# Altium schematic sheet CAN BUS FOR STM32.SchDoc
size A2
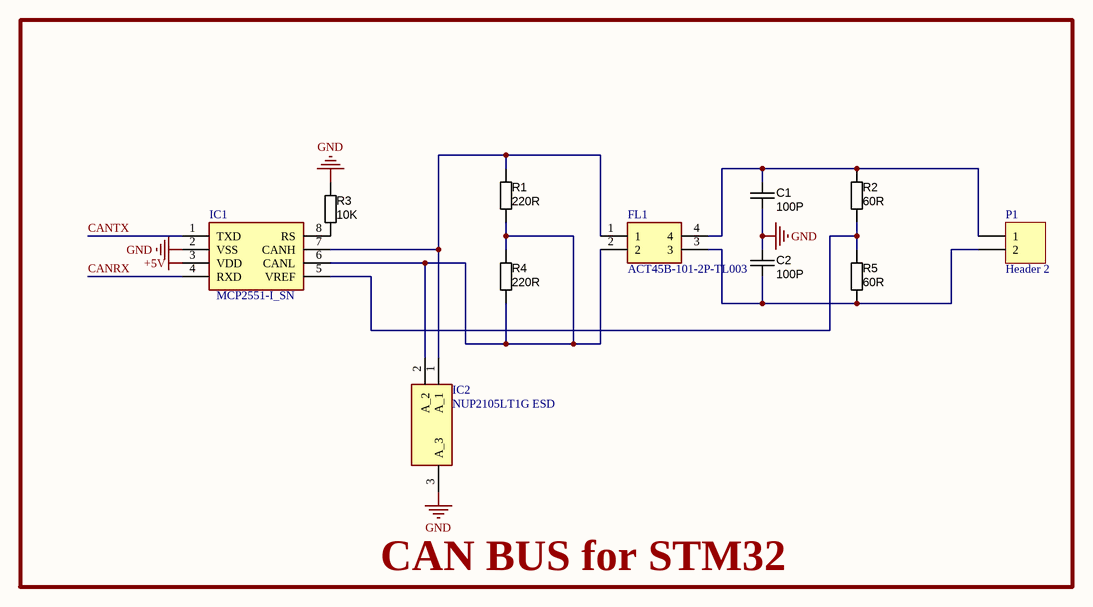
[diagram p0: CAN BUS FOR STM32.SchDoc]

## Parts
C1  value 100P  [CAPC2012X135N]  (hidden comment: approved sub OK)
C2  value 100P  [CAPC2012X135N]  (hidden comment: approved sub OK)
FL1  ACT45B-101-2P-TL003  [ACT45B1012PTL003]
IC1  MCP2551-I_SN  [SOIC127P600X175-8N]
IC2  NUP2105LT1G ESD  [SOT96P237X111-3N]
P1  Header 2  [Terminal kf128 2pin 5.0]
R1  value 220R  [RESC2012N_ZERO]  (hidden comment: Jumper)
R2  value 60R  [RESC2012N_ZERO]  (hidden comment: Jumper)
R3  value 10K  [RESC2012N_ZERO]  (hidden comment: Jumper)
R4  value 220R  [RESC2012N_ZERO]  (hidden comment: Jumper)
R5  value 60R  [RESC2012N_ZERO]  (hidden comment: Jumper)

## Blocks framed on the sheet
CAN BUS for STM32: C1 C2 FL1 IC1 IC2 P1 R1-R5

## Nets
+5V: IC1.3(VDD)
GND: C1.2 C2.1 IC1.2(VSS) IC2.3(A_3) R3.1
CANRX: IC1.4(RXD)
CANTX: IC1.1(TXD)
NetC1_1: C1.1 FL1.4 P1.1 R2.1
NetC2_2: C2.2 FL1.3 P1.2 R5.2
NetFL1_1: FL1.1 IC1.7(CANH) IC2.1(A_1) R1.1
NetFL1_2: FL1.2 IC1.6(CANL) IC2.2(A_2) R1.2 R4.1 R4.2
NetIC1_5: IC1.5(VREF) R2.2 R5.1
NetIC1_8: IC1.8(RS) R3.2

## Library data of the parts
C1 C2 = CAPC_100n_0805_X7R_100V_10%: Capacitor SMD Cer 100pF 10% 100V X7R 0805; Manufacturer 1: TDK Corporation; Manufacturer Part Number 1: C2012X7R2A104K; Ratings: 100V; X7R; Material: ceramic; SCDType: undef; Package / Case: 0805; Tolerance: ±10%; Supplier 1: Digi-Key; Supplier Part Number 1: 445-1418-1-ND
FL1 = ACT45B-101-2P-TL003: Filter; Manufacturer_Name: TDK; Datasheet Link: https://product.tdk.com/system/files/dam/doc/product/emc/emc/cmf_cmc/catalog/cmf_automotive_signal_act45b_en.pdf; Height: 3mm; Manufacturer_Part_Number: ACT45B-101-2P-TL003; Mouser Part Number: 810-ACT45B1012PTL003; Mouser Price/Stock: https://www.mouser.co.uk/ProductDetail/TDK/ACT45B-101-2P-TL003?qs=SKgu1TwNDxoLFWvwfqJuJA%3D%3D; Arrow Part Number: ACT45B-101-2P-TL003; Arrow Price/Stock: https://www.arrow.com/en/products/act45b-101-2p-tl003/tdk?region=nac
IC1 = MCP2551-I_SN: Integrated Circuit; Manufacturer_Name: Microchip; Manufacturer_Part_Number: MCP2551-I/SN; Datasheet Link: https://datasheet.datasheetarchive.com/originals/distributors/Datasheets-34/DSA-674994.pdf; Height: 1.75mm; Mouser Part Number: 579-MCP2551-I/SN; Mouser Price/Stock: https://www.mouser.co.uk/ProductDetail/Microchip-Technology/MCP2551-I-SN?qs=9y3LFqDLL8L5zFfqqxdOHg%3D%3D; Arrow Part Number: MCP2551-I/SN; Arrow Price/Stock: https://www.arrow.com/en/products/mcp2551-isn/microchip-technology?region=nac
IC2 = NUP2105LT1G: Integrated Circuit; Manufacturer_Name: onsemi; Datasheet Link: https://www.onsemi.com/pub/Collateral/NUP2105L-D.PDF; Height: 1.11mm; Manufacturer_Part_Number: NUP2105LT1G; Mouser Part Number: 863-NUP2105LT1G; Mouser Price/Stock: https://www.mouser.co.uk/ProductDetail/onsemi/NUP2105LT1G?qs=ZXBb0xZ9WeDHmiHN%252BYKtYA%3D%3D; Arrow Part Number: NUP2105LT1G; Arrow Price/Stock: https://www.arrow.com/en/products/nup2105lt1g/on-semiconductor?region=nac
P1 = Header 2: Header, 2-Pin; LatestRevisionDate: 17-Jul-2002; LatestRevisionNote: Re-released for DXP Platform.; Publisher: Altium Limited
R1 R4 = RES_0R_0805: Resistor SMD chip 220 Ohm 0.125W 0805; Manufacturer 1: Samsung Electro-Mechanics America, Inc; Manufacturer Part Number 1: RC2012J000CS; Ratings: 1/8W; SCDType: spec; Tolerance: N/A; Package / Case: 0805 (2012 metric); Supplier 1: Digi-Key; Supplier Part Number 1: 1276-5466-6-ND; RoHS 1: RoHS Compliant; ComponentLink1URL: http://www.samsungsem.com/servlet/FileDownload?filename=productcatalog/pdf/Chip_Resistor.pdf; ComponentLink1Description: http://www.samsungsem.com/servlet/FileDownload?filename=productcatalog/pdf/Chip_Resistor.pdf; Supplier 2: Digi-Key; Supplier Part Number 2: RMCF0805ZT0R00DKR-ND; Manufacturer 2: Stackpole Electronics Inc; Manufacturer Part Number 2: RMCF0805ZT0R00; RoHS 2: RoHS Compliant; ComponentLink2URL: http://www.seielect.com/Catalog/SEI-RMCF_RMCP.pdf; ComponentLink2Description: http://www.seielect.com/Catalog/SEI-RMCF_RMCP.pdf; Supplier 3: Digi-Key; Supplier Part Number 3: 311-0.0ARDKR-ND; Manufacturer 3: Yageo; Manufacturer Part Number 3: RC0805JR-070RL; RoHS 3: RoHS Compliant; ComponentLink3URL: http://media.digikey.com/pdf/Data%20Sheets/Yageo%20PDFs/RC0805%20Pb%20Free.pdf; ComponentLink3Description: http://media.digikey.com/pdf/Data%20Sheets/Yageo%20PDFs/RC0805%20Pb%20Free.pdf; Supplier 4: Digi-Key; Supplier Part Number 4: P0.0ADKR-ND; Manufacturer 4: Panasonic Electronic Components; Manufacturer Part Number 4: ERJ-6GEY0R00V; RoHS 4: RoHS Compliant; ComponentLink4URL: http://industrial.panasonic.com/www-cgi/jvcr13pz.cgi?E+PZ+3+AOA0001+ERJ6GEY0R00V+7+WW; ComponentLink4Description: http://industrial.panasonic.com/www-cgi/jvcr13pz.cgi?E+PZ+3+AOA0001+ERJ6GEY0R00V+7+WW; Supplier 5: Digi-Key; Supplier Part Number 5: RHM0.0CPDKR-ND; Manufacturer 5: Rohm Semiconductor; Manufacturer Part Number 5: MCR10ERTJ000; RoHS 5: RoHS Compliant; ComponentLink5URL: http://rohmfs.rohm.com/en/products/databook/datasheet/passive/resistor/chip_resistor/mcr_g.pdf; ComponentLink5Description: http://rohmfs.rohm.com/en/products/databook/datasheet/passive/resistor/chip_resistor/mcr_g.pdf
R2 R5 = RES_0R_0805: Resistor SMD chip 60 Ohm 0.125W 0805; Manufacturer 1: Samsung Electro-Mechanics America, Inc; Manufacturer Part Number 1: RC2012J000CS; Ratings: 1/8W; SCDType: spec; Tolerance: N/A; Package / Case: 0805 (2012 metric); Supplier 1: Digi-Key; Supplier Part Number 1: 1276-5466-6-ND; RoHS 1: RoHS Compliant; ComponentLink1URL: http://www.samsungsem.com/servlet/FileDownload?filename=productcatalog/pdf/Chip_Resistor.pdf; ComponentLink1Description: http://www.samsungsem.com/servlet/FileDownload?filename=productcatalog/pdf/Chip_Resistor.pdf; Supplier 2: Digi-Key; Supplier Part Number 2: RMCF0805ZT0R00DKR-ND; Manufacturer 2: Stackpole Electronics Inc; Manufacturer Part Number 2: RMCF0805ZT0R00; RoHS 2: RoHS Compliant; ComponentLink2URL: http://www.seielect.com/Catalog/SEI-RMCF_RMCP.pdf; ComponentLink2Description: http://www.seielect.com/Catalog/SEI-RMCF_RMCP.pdf; Supplier 3: Digi-Key; Supplier Part Number 3: 311-0.0ARDKR-ND; Manufacturer 3: Yageo; Manufacturer Part Number 3: RC0805JR-070RL; RoHS 3: RoHS Compliant; ComponentLink3URL: http://media.digikey.com/pdf/Data%20Sheets/Yageo%20PDFs/RC0805%20Pb%20Free.pdf; ComponentLink3Description: http://media.digikey.com/pdf/Data%20Sheets/Yageo%20PDFs/RC0805%20Pb%20Free.pdf; Supplier 4: Digi-Key; Supplier Part Number 4: P0.0ADKR-ND; Manufacturer 4: Panasonic Electronic Components; Manufacturer Part Number 4: ERJ-6GEY0R00V; RoHS 4: RoHS Compliant; ComponentLink4URL: http://industrial.panasonic.com/www-cgi/jvcr13pz.cgi?E+PZ+3+AOA0001+ERJ6GEY0R00V+7+WW; ComponentLink4Description: http://industrial.panasonic.com/www-cgi/jvcr13pz.cgi?E+PZ+3+AOA0001+ERJ6GEY0R00V+7+WW; Supplier 5: Digi-Key; Supplier Part Number 5: RHM0.0CPDKR-ND; Manufacturer 5: Rohm Semiconductor; Manufacturer Part Number 5: MCR10ERTJ000; RoHS 5: RoHS Compliant; ComponentLink5URL: http://rohmfs.rohm.com/en/products/databook/datasheet/passive/resistor/chip_resistor/mcr_g.pdf; ComponentLink5Description: http://rohmfs.rohm.com/en/products/databook/datasheet/passive/resistor/chip_resistor/mcr_g.pdf
R3 = RES_0R_0805: Resistor SMD chip 10KOhm 0.125W 0805; Manufacturer 1: Samsung Electro-Mechanics America, Inc; Manufacturer Part Number 1: RC2012J000CS; Ratings: 1/8W; SCDType: spec; Tolerance: N/A; Package / Case: 0805 (2012 metric); Supplier 1: Digi-Key; Supplier Part Number 1: 1276-5466-6-ND; RoHS 1: RoHS Compliant; ComponentLink1URL: http://www.samsungsem.com/servlet/FileDownload?filename=productcatalog/pdf/Chip_Resistor.pdf; ComponentLink1Description: http://www.samsungsem.com/servlet/FileDownload?filename=productcatalog/pdf/Chip_Resistor.pdf; Supplier 2: Digi-Key; Supplier Part Number 2: RMCF0805ZT0R00DKR-ND; Manufacturer 2: Stackpole Electronics Inc; Manufacturer Part Number 2: RMCF0805ZT0R00; RoHS 2: RoHS Compliant; ComponentLink2URL: http://www.seielect.com/Catalog/SEI-RMCF_RMCP.pdf; ComponentLink2Description: http://www.seielect.com/Catalog/SEI-RMCF_RMCP.pdf; Supplier 3: Digi-Key; Supplier Part Number 3: 311-0.0ARDKR-ND; Manufacturer 3: Yageo; Manufacturer Part Number 3: RC0805JR-070RL; RoHS 3: RoHS Compliant; ComponentLink3URL: http://media.digikey.com/pdf/Data%20Sheets/Yageo%20PDFs/RC0805%20Pb%20Free.pdf; ComponentLink3Description: http://media.digikey.com/pdf/Data%20Sheets/Yageo%20PDFs/RC0805%20Pb%20Free.pdf; Supplier 4: Digi-Key; Supplier Part Number 4: P0.0ADKR-ND; Manufacturer 4: Panasonic Electronic Components; Manufacturer Part Number 4: ERJ-6GEY0R00V; RoHS 4: RoHS Compliant; ComponentLink4URL: http://industrial.panasonic.com/www-cgi/jvcr13pz.cgi?E+PZ+3+AOA0001+ERJ6GEY0R00V+7+WW; ComponentLink4Description: http://industrial.panasonic.com/www-cgi/jvcr13pz.cgi?E+PZ+3+AOA0001+ERJ6GEY0R00V+7+WW; Supplier 5: Digi-Key; Supplier Part Number 5: RHM0.0CPDKR-ND; Manufacturer 5: Rohm Semiconductor; Manufacturer Part Number 5: MCR10ERTJ000; RoHS 5: RoHS Compliant; ComponentLink5URL: http://rohmfs.rohm.com/en/products/databook/datasheet/passive/resistor/chip_resistor/mcr_g.pdf; ComponentLink5Description: http://rohmfs.rohm.com/en/products/databook/datasheet/passive/resistor/chip_resistor/mcr_g.pdf